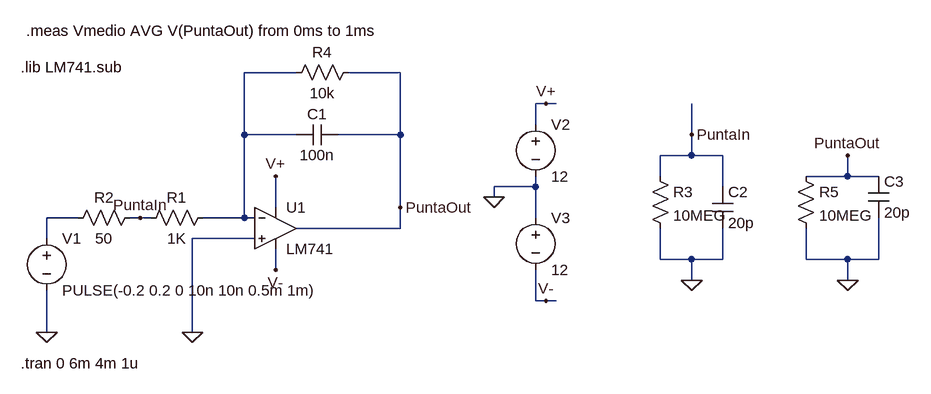
[diagram p0: schematic B-R2-puntasx10.asc]
B-R2-puntasx10.asc, the LTspice schematic file:
Version 4
SHEET 1 1128 680
WIRE 160 -16 80 -16
WIRE 320 -16 240 -16
WIRE 544 32 528 32
WIRE 560 32 544 32
WIRE 528 64 528 32
WIRE 80 80 80 -16
WIRE 160 80 80 80
WIRE 320 80 320 -16
WIRE 320 80 224 80
WIRE 768 80 768 32
WIRE 768 112 768 80
WIRE 768 112 720 112
WIRE 816 112 768 112
WIRE 720 144 720 112
WIRE 1008 144 1008 112
WIRE 1008 144 944 144
WIRE 1056 144 1008 144
WIRE 528 160 528 144
WIRE 528 160 464 160
WIRE 816 160 816 112
WIRE 464 176 464 160
WIRE 128 192 128 144
WIRE 320 192 320 80
WIRE -176 208 -224 208
WIRE -80 208 -96 208
WIRE -64 208 -80 208
WIRE 80 208 80 80
WIRE 80 208 16 208
WIRE 96 208 80 208
WIRE 528 208 528 160
WIRE 320 224 320 192
WIRE 320 224 160 224
WIRE -224 240 -224 208
WIRE 96 240 0 240
WIRE 720 272 720 224
WIRE 768 272 720 272
WIRE 816 272 816 224
WIRE 816 272 768 272
WIRE 944 272 944 224
WIRE 1008 272 944 272
WIRE 1056 272 1056 208
WIRE 1056 272 1008 272
WIRE 128 288 128 256
WIRE 768 304 768 272
WIRE 1008 304 1008 272
WIRE 528 336 528 288
WIRE 544 336 528 336
WIRE 560 336 544 336
WIRE -224 384 -224 320
WIRE 0 384 0 240
FLAG 0 384 0
FLAG -224 384 0
FLAG 464 176 0
FLAG 544 32 V+
FLAG 544 336 V-
FLAG 128 288 V-
FLAG 128 144 V+
FLAG 768 304 0
FLAG 768 80 PuntaIn
FLAG 1008 304 0
FLAG 1008 112 PuntaOut
FLAG -80 208 PuntaIn
FLAG 320 192 PuntaOut
SYMBOL Opamps\\opamp2 128 160 R0
SYMATTR InstName U1
SYMATTR Value LM741
SYMBOL res 32 192 R90
WINDOW 0 0 56 VBottom 2
WINDOW 3 32 56 VTop 2
SYMATTR InstName R1
SYMATTR Value 1K
SYMBOL voltage -224 224 R0
WINDOW 123 0 0 Left 2
WINDOW 39 0 0 Left 2
SYMATTR InstName V1
SYMATTR Value PULSE(-0.2 0.2 0 10n 10n 0.5m 1m)
SYMBOL cap 224 64 R90
WINDOW 0 0 32 VBottom 2
WINDOW 3 32 32 VTop 2
SYMATTR InstName C1
SYMATTR Value 100n
SYMBOL voltage 528 48 R0
WINDOW 123 0 0 Left 2
WINDOW 39 0 0 Left 2
SYMATTR InstName V2
SYMATTR Value 12
SYMBOL voltage 528 192 R0
WINDOW 123 0 0 Left 2
WINDOW 39 0 0 Left 2
SYMATTR InstName V3
SYMATTR Value 12
SYMBOL res 704 128 R0
SYMATTR InstName R3
SYMATTR Value 10MEG
SYMBOL cap 800 160 R0
SYMATTR InstName C2
SYMATTR Value 20p
SYMBOL res -80 192 R90
WINDOW 0 0 56 VBottom 2
WINDOW 3 32 56 VTop 2
SYMATTR InstName R2
SYMATTR Value 50
SYMBOL res 928 128 R0
SYMATTR InstName R5
SYMATTR Value 10MEG
SYMBOL cap 1040 144 R0
SYMATTR InstName C3
SYMATTR Value 20p
SYMBOL res 256 -32 R90
WINDOW 0 0 56 VBottom 2
WINDOW 3 32 56 VTop 2
SYMATTR InstName R4
SYMATTR Value 10k
TEXT -264 -24 Left 2 !.lib LM741.sub
TEXT -264 432 Left 2 !.tran 0 6m 4m 1u
TEXT -256 -80 Left 2 !.meas Vmedio AVG V(PuntaOut) from 0ms to 1ms

The netlist it stands for:
* B-R2-puntasx10.asc
XU1 0 N001 V+ V- PuntaOut LM741  ; pins In+ In- V+ V- OUT
R1 N001 PuntaIn 1K
V1 N002 0 PULSE(-0.2 0.2 0 10n 10n 0.5m 1m)
C1 PuntaOut N001 100n
V2 V+ 0 12
V3 0 V- 12
R3 PuntaIn 0 10MEG
C2 PuntaIn 0 20p
R2 PuntaIn N002 50
R5 PuntaOut 0 10MEG
C3 PuntaOut 0 20p
R4 PuntaOut N001 10k
.lib LM741.sub
.tran 0 6m 4m 1u
.meas Vmedio AVG V(PuntaOut) from 0ms to 1ms
.backanno
.end